# Altium schematic sheet CL31B475KBHNNNE1_CL31B475KBHNNNE.schdoc
size 124 x 101 mm
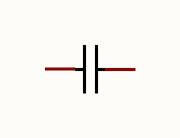
[diagram p0: CL31B475KBHNNNE1_CL31B475KBHNNNE.schdoc]

## Parts
C?  4.7uF  [C1206]  (value not drawn)

## Nets

Not connected (* = marked no-connect by the designer): C? 1 2

## Library data of the parts
C? = CL31B475KBHNNNE: Manufacturer: SAMSUNG(三星); Add into BOM: yes; Tolerance: ±10%; Voltage Rated: 50V; Temperature Coefficient: X7R; Symbol: CL31B475KBHNNNE; Device: CL31B475KBHNNNE; LCSC Part Name: 4.7uF ±10% 50V; Supplier Part: C51205; Manufacturer Part: CL31B475KBHNNNE; Supplier Footprint: 1206; JLCPCB Part Class: Extended Part; Datasheet: https://atta.szlcsc.com/upload/public/pdf/source/20160218/1457707763339.pdf; Supplier: LCSC; Convert to PCB: yes; Value: 4.7uF